# EAGLE design Si4735 Breakout-v10 (EAGLE 5.06)
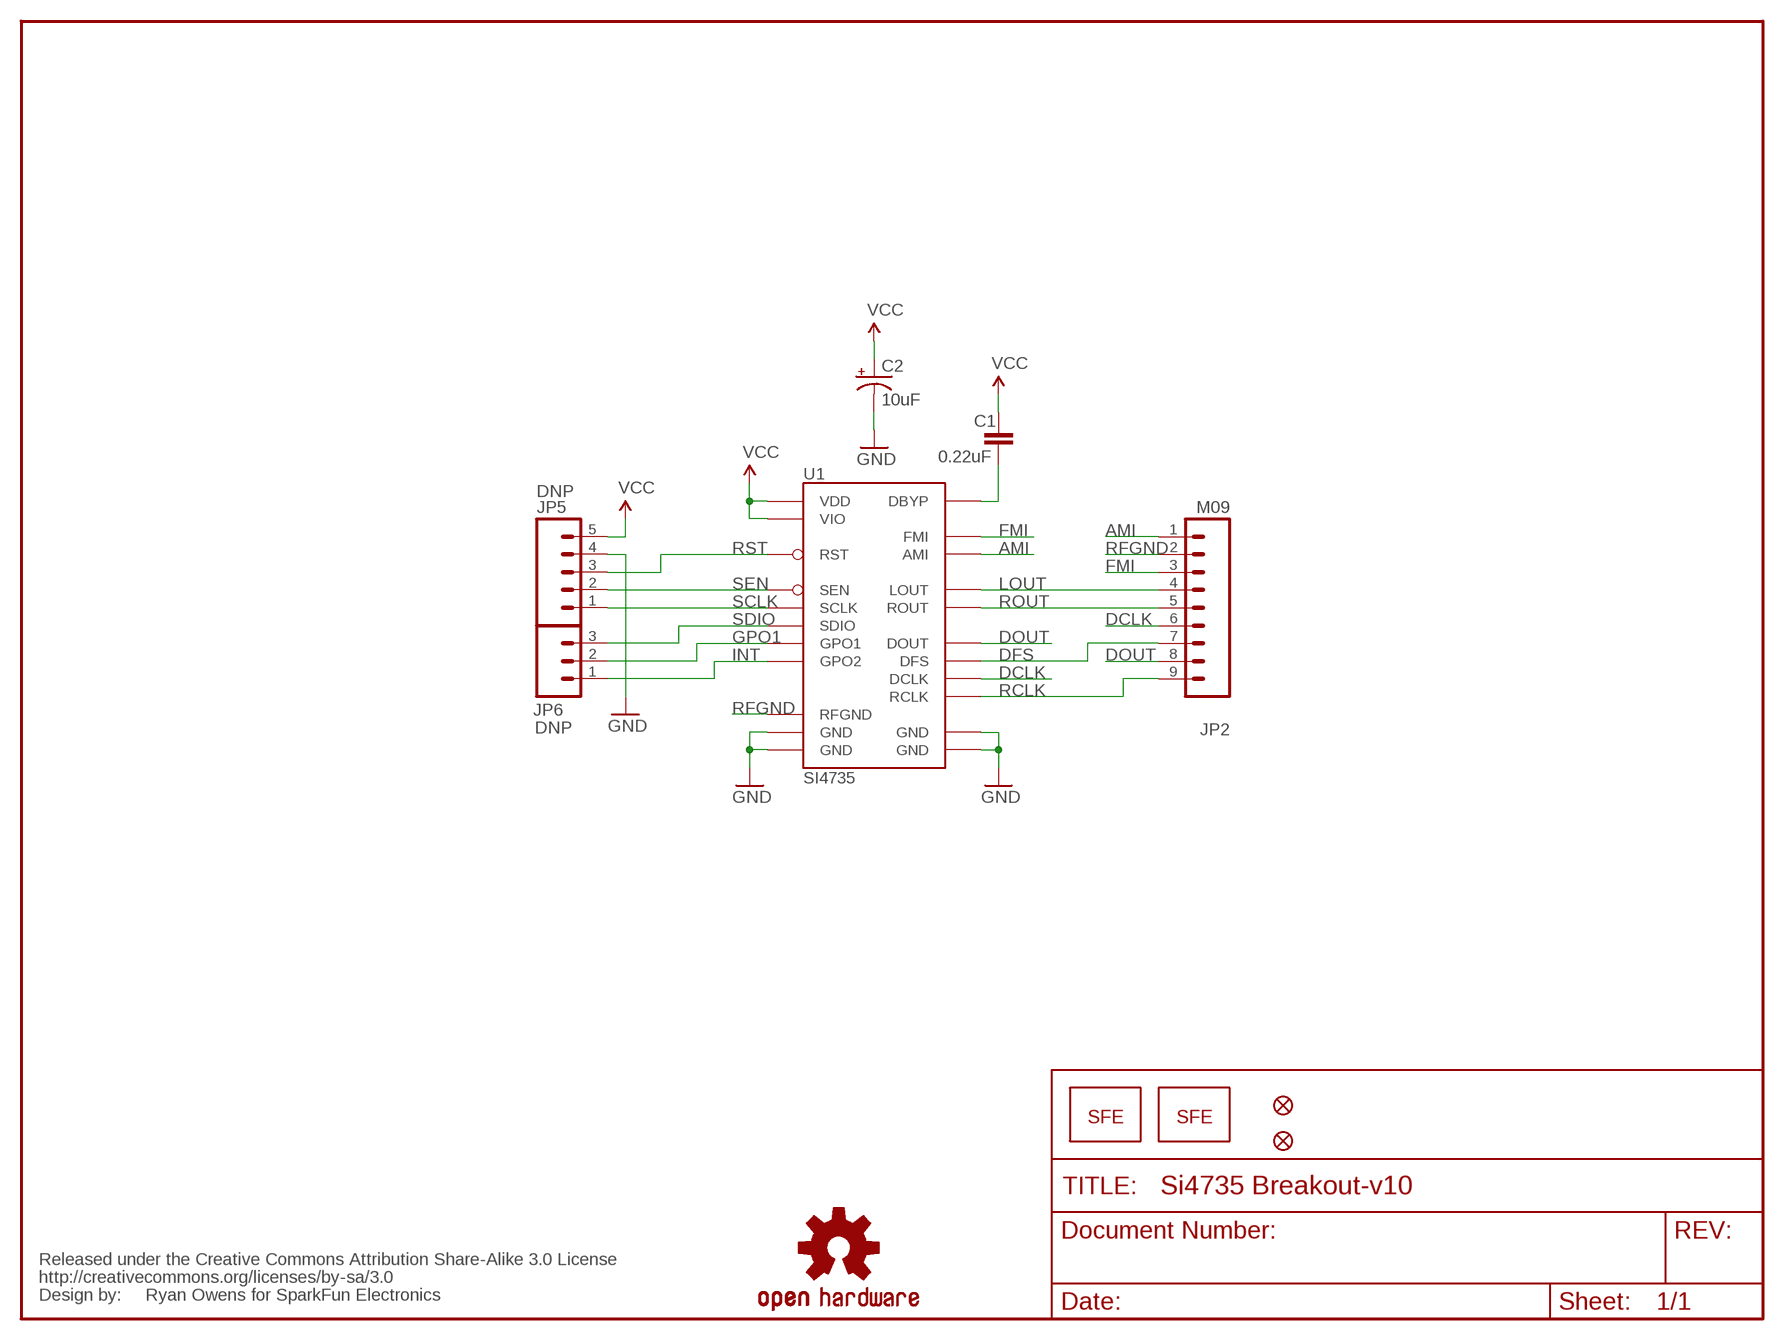
[diagram p0: schematic, sheet 1]

## Parts
C1  0.22uF  CAP0402-CAP  [0402-CAP]
C2  10uF  CAP_POL3528  [EIA3528]
JP1  LOGO-SFENEW  [SFE-NEW-WEBLOGO]
JP2  M09  [1X09]
JP3  LOGO-SFESK  [SFE-LOGO-FLAME]
JP4  FIDUCIAL1X2.5  [FIDUCIAL-1X2.5]
JP5  DNP  M05PTH  [1X05]
JP6  DNP  M03PTH  [1X03]
JP7  FIDUCIAL1X2.5  [FIDUCIAL-1X2.5]
U1  SI4735  [SSOP24_NARROW]
U$1  CREATIVE_COMMONS  [CREATIVE_COMMONS]
U$2  OSHW-LOGOS  [OSHW-LOGO-S]

## Nets
AMI: JP2.1 U1.12(AMI)
DCLK: JP2.6 U1.3(DCLK)
DFS: JP2.7 U1.2(DFS)
DOUT: JP2.8 U1.1(DOUT)
FMI: JP2.3 U1.8(FMI)
GND: C2.C(-) JP5.4 U1.10(GND) U1.11(GND) U1.13(GND) U1.14(GND)
GPO1: JP6.2 U1.5(GPO1)
INT: JP6.1 U1.4(GPO2)
LOUT: JP2.4 U1.24(LOUT)
N$4: C1.2 U1.22(DBYP)
RCLK: JP2.9 U1.19(RCLK)
RFGND: JP2.2 U1.9(RFGND)
ROUT: JP2.5 U1.23(ROUT)
RST: JP5.3 U1.15(RST)
SCLK: JP5.1 U1.17(SCLK)
SDIO: JP6.3 U1.18(SDIO)
SEN: JP5.2 U1.16(SEN)
VCC: C1.1 C2.A(+) JP5.5 U1.20(VIO) U1.21(VDD)

## Notes on the sheet
- Ryan Owens for SparkFun Electronics

## Library data of the parts
C1 = SparkFun:CAP: Capacitor Standard 0603 ceramic capacitor, and 0.1" leaded capacitor.
C2 = SparkFun:CAP_POL: Capacitor Polarized These are standard SMD and PTH capacitors. Normally 10uF, 47uF, and 100uF in electrolytic and tantalum varieties. Always verify the external diameter of the through hole cap, it varies with capacity, voltage, and manufacturer. The EIA devices should be standard.
JP1 JP3 = SparkFun:LOGO-SFE: Spark Fun Electronics PCB Logo This is the standard Spark Fun Electronics PCB logo.
JP2 = SparkFun:M09: Header 9 Standard 9-pin 0.1" header. Use with straight break away headers (SKU : PRT-00116), right angle break away headers (PRT-00553), swiss pins (PRT-00743), machine pins (PRT-00117), and female headers (PRT-00115).
JP4 JP7 = abes:FIDUCIAL: Fiducial Alignment Points Various fiducial points for machine vision alignment.
JP5 = SparkFun:M05: Header 5 Standard 5-pin 0.1" header. Use with straight break away headers (SKU : PRT-00116), right angle break away headers (PRT-00553), swiss pins (PRT-00743), machine pins (PRT-00117), and female headers (PRT-00115). Molex polarized connector foot print use with SKU : PRT-08230 with associated crimp pins and housings.
JP6 = SparkFun:M03: Header 3 Standard 3-pin 0.1" header. Use with straight break away headers (SKU : PRT-00116), right angle break away headers (PRT-00553), swiss pins (PRT-00743), machine pins (PRT-00117), and female headers (PRT-00115). Molex polarized connector foot print use with SKU : PRT-08232 with associated crimp pins and housings.
U1 = SparkFun:SI4735: Radio chip that covers FM broadcast with RDS, plus a bunch of shortwave and logwave frequencies
U$1 = SparkFun:CREATIVE_COMMONS
U$2 = SparkFun:OSHW-LOGO: Open Source Hardware Logo This logo indicates the piece of hardware it is found on incorporates a OSHW license and/or adheres to the definition of open source hardware found here: http://freedomdefined.org/OSHW

## Net classes
1 vcc: width 0.254 mm

## Board
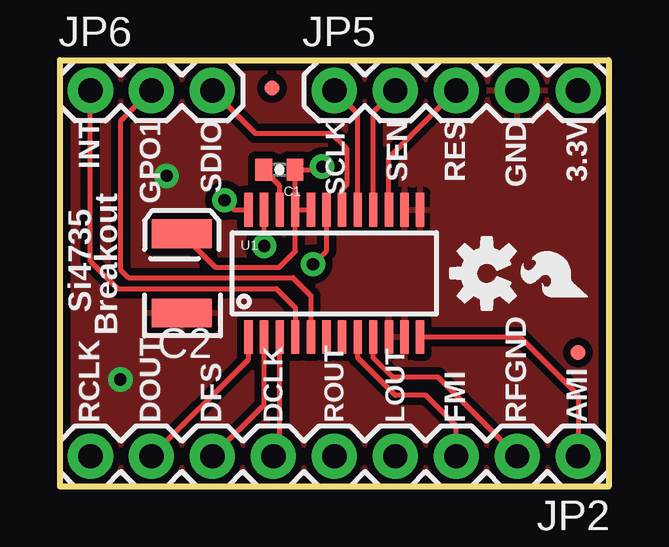
[diagram p1: board, top side]
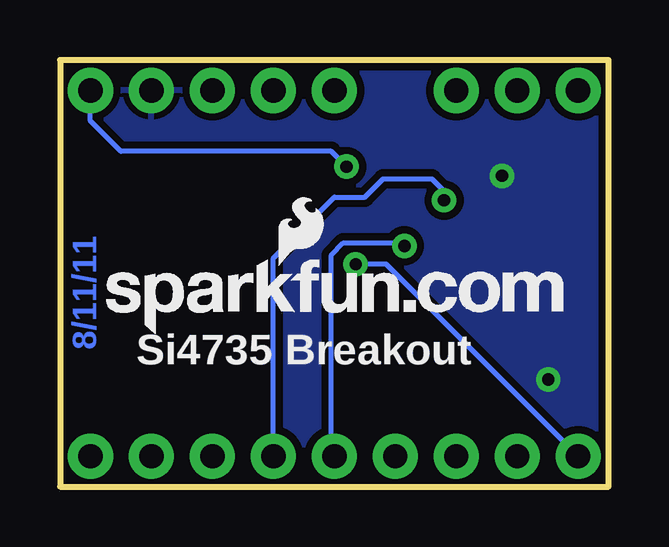
[diagram p2: board, bottom side, seen from below]

Size 22.86 x 17.78 mm. Coordinates in mm from the lower left corner, seen from the top.
Outline: 0,0 0,17.78 22.86,17.78 22.86,0 0,0
Copper layers (1*16): Top 0.035mm / dielectric 1.5mm / Bottom 0.035mm
Design rules "SparkFun *": minimum track width 8mil, minimum drill 20mil, track to track 8mil, track to pad 8mil, pad to pad 8mil, via to via 8mil, smd to smd 8mil, copper to edge 8mil, drill to drill 8mil, minimum pad ring 12mil, minimum via ring 10mil, stop-mask expansion 4mil, vias tented up to drill 25mil, thermal gap 10mil

### Footprints (pad centres in the part's own frame; a part is rotated, then mirrored left to right if it is on the bottom)
0402-CAP = smd 0.7 x 0.9: 1 -0.65,0; 2 0.65,0
EIA3528 = smd 1.2 x 2.5: A 1.65,0; C -1.65,0
1X09 = drill 1.016 pad 1.88 round: 1 0,0; 2 2.54,0; 3 5.08,0; 4 7.62,0; 5 10.16,0; 6 12.7,0; 7 15.24,0; 8 17.78,0; 9 20.32,0
FIDUCIAL-1X2.5 = smd 0.635 x 0.635: 1 0,0
1X05 = drill 1.016 pad 1.88 round: 1 0,0; 2 2.54,0; 3 5.08,0; 4 7.62,0; 5 10.16,0
1X03 = drill 1.016 pad 1.88 round: 1 0,0; 2 2.54,0; 3 5.08,0
SSOP24_NARROW = smd 0.348 x 1.397: 1 -3.575,-2.65; 2 -2.925,-2.65; 3 -2.275,-2.65; 4 -1.625,-2.65; 5 -0.975,-2.65; 6 -0.325,-2.65; 7 0.325,-2.65; 8 0.975,-2.65; 9 1.625,-2.65; 10 2.275,-2.65; 11 2.925,-2.65; 12 3.575,-2.65; 13 3.575,2.65; 14 2.925,2.65; 15 2.275,2.65; 16 1.625,2.65; 17 0.975,2.65; 18 0.325,2.65; 19 -0.325,2.65; 20 -0.975,2.65; 21 -1.625,2.65; 22 -2.275,2.65; 23 -2.925,2.65; 24 -3.575,2.65

### Placement (x,y rotation side)
C1  9.14,13.21 180 top
C2  5.08,8.89 90 top
JP1  20.95,6.35 0 bottom
JP2  21.59,1.27 180 top
JP3  22,7.92 90 top
JP4  8.84,16.61 0 top
JP5  11.43,16.51 0 top
JP6  1.27,16.51 0 top
JP7  21.59,5.59 0 top
U1  11.43,8.89 0 top
U$1  10.16,-19.05 0 top  (outside the outline)
U$2  17.78,8.89 90 top

### Tracks (layer width: path | path; a pad name or v marks a point on that pad's centre or on a via)
AMI
  Top 0.203: U1.12 19.16,6.24 21.59,3.81 JP2.1
DCLK
  Top 0.203: U1.3 9.15,1.53 JP2.6
DFS
  Top 0.203: U1.2 8.51,3.42 JP2.7
DOUT
  Top 0.203: U1.1 7.86,5.32 JP2.8
FMI
  Top 0.203: U1.8 12.4,5.38 13.97,3.81 15.24,3.81 16.51,2.54 JP2.3
GND  (via drill 0.51)
  other vias: 4.45,12.95 2.51,4.47
  pour Bottom (isolate 0.305): 0,0 0,17.78 22.86,17.78 22.86,0
  pour Top (isolate 0.305): 0,0 0,17.78 22.86,17.78 22.86,0
GPO1
  Top 0.203: U1.5 10.46,7.96 9.7,8.71 2.85,8.71 2.54,9.02 2.54,15.24 JP6.2
INT
  Top 0.203: U1.4 9.8,7.47 9.02,8.26 2.41,8.26 1.27,9.4 JP6.1
LOUT  (via drill 0.51)
  Top 0.203: U1.24 7.26,11.54 v6.86,11.94
  Bottom 0.203: v6.86,11.94 6.86,12.32 7.37,12.83 9.4,12.83 10.16,12.06 11.43,12.06 13.97,9.53 JP2.4
N$4
  Top 0.203: U1.22 9.15,12.55 C1.2
RCLK  (via drill 0.51)
  Top 0.203: U1.19 11.11,9.84 v10.54,9.27
  Bottom 0.203: JP2.9 9.27,9.27 v10.54,9.27
RFGND
  Top 0.203: U1.9 13.05,5.36 13.84,4.57 15.75,4.57 JP2.2
ROUT  (via drill 0.51)
  Top 0.203: U1.23 v8.51,10.04 v8.51,10.03
  Bottom 0.203: JP2.5 11.56,1.4 11.56,9.65 11.05,10.16 8.64,10.16 v8.51,10.03
RST
  Top 0.203: U1.15 13.71,13.71 JP5.3
SCLK
  Top 0.203: U1.17 12.4,15.54 JP5.1
SDIO
  Top 0.203: U1.18 11.76,12.39 11.94,12.57 11.94,14.1 11.3,14.73 8.13,14.73 JP6.3
SEN
  Top 0.203: U1.16 13.05,15.6 JP5.2
VCC  (via drill 0.51)
  Top 0.203: U1.21 U1.20 | U1.21 9.8,9.8 9.14,9.14 6.48,9.14 C2.A | U1.21 9.8,13.2 C1.1 10.79,13.21 v10.92,13.34
  Bottom 0.203: v10.92,13.34 11.56,13.97 20.32,13.97 21.59,15.24 JP5.5

### Text on the board
Bottom: 8/11/11
tPlace: INT | GPO1 | SDIO | SCLK | SEN | RES | GND | 3.3V | Si4735 | Breakout | RCLK | DOUT | DFS | DCLK | ROUT | LOUT | FMI | RFGND | AMI
bPlace: Si4735 Breakout
Reference: Ryan Owens for SparkFun Electronics